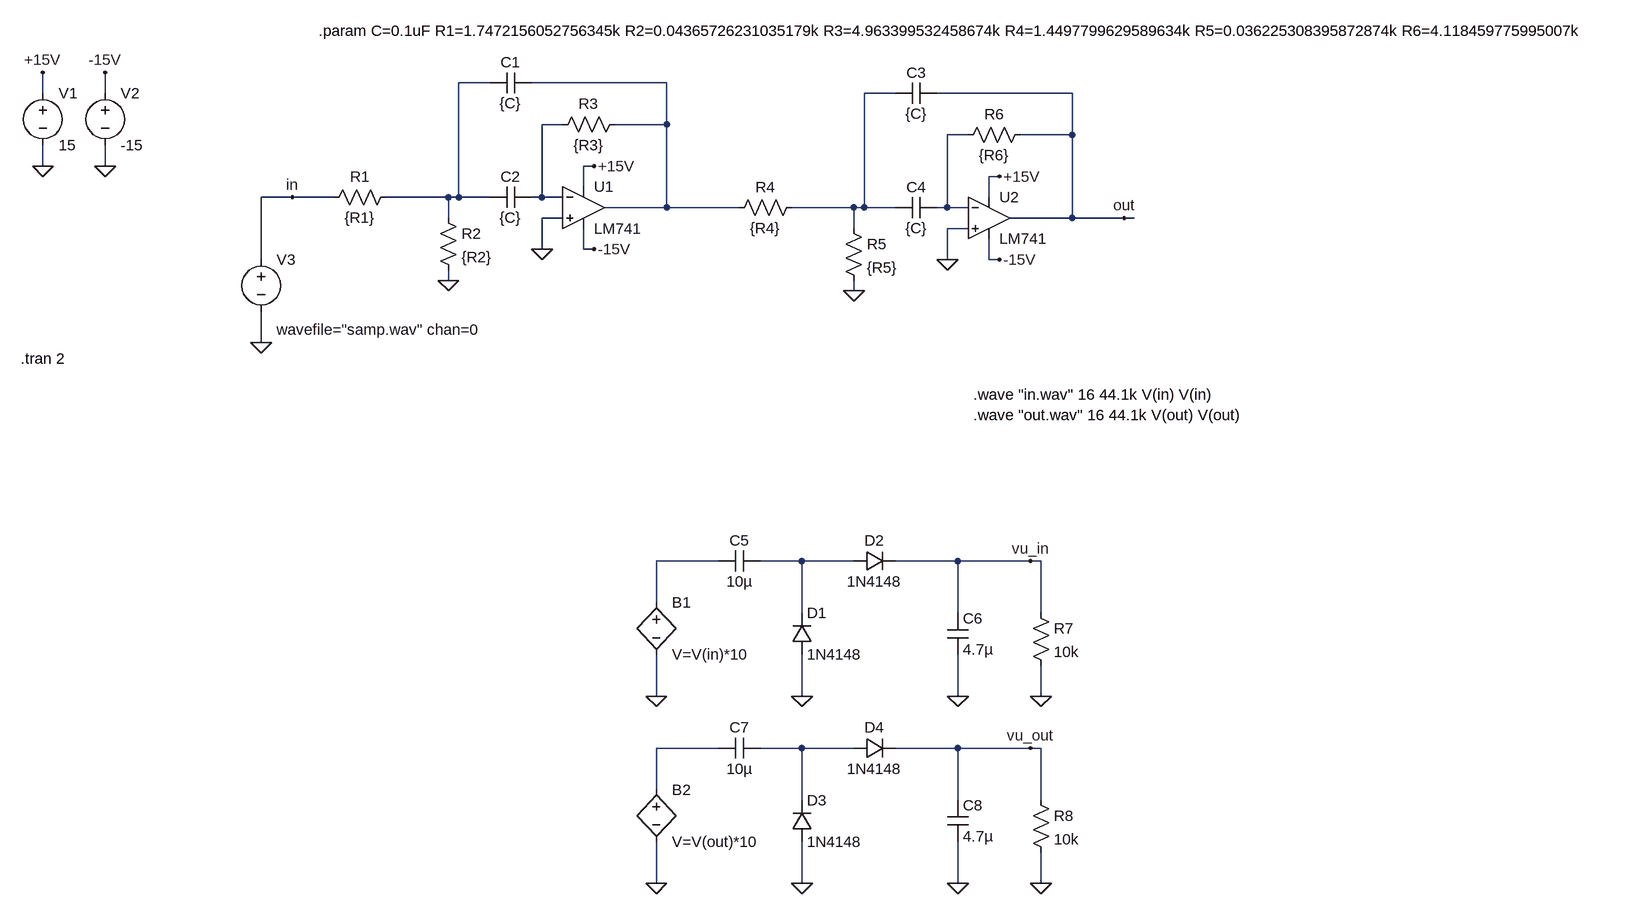
[diagram p0: schematic tone_detect.asc]
tone_detect.asc, the LTspice schematic file:
Version 4
SHEET 1 1964 1188
WIRE 64 -64 16 -64
WIRE 336 -64 128 -64
WIRE -624 -48 -624 -80
WIRE -528 -48 -528 -80
WIRE 688 -48 640 -48
WIRE 960 -48 752 -48
WIRE 176 0 144 0
WIRE 336 0 336 -64
WIRE 336 0 256 0
WIRE 800 16 768 16
WIRE 960 16 960 -48
WIRE 960 16 880 16
WIRE -624 64 -624 32
WIRE -528 64 -528 32
WIRE 224 64 208 64
WIRE 848 80 832 80
WIRE 208 96 208 64
WIRE -240 112 -288 112
WIRE -176 112 -240 112
WIRE 0 112 -96 112
WIRE 16 112 16 -64
WIRE 16 112 0 112
WIRE 64 112 16 112
WIRE 144 112 144 0
WIRE 144 112 128 112
WIRE 176 112 144 112
WIRE 832 112 832 80
WIRE 336 128 336 0
WIRE 336 128 240 128
WIRE 448 128 336 128
WIRE 624 128 528 128
WIRE 640 128 640 -48
WIRE 640 128 624 128
WIRE 688 128 640 128
WIRE 768 128 768 16
WIRE 768 128 752 128
WIRE 800 128 768 128
WIRE 0 144 0 112
WIRE 176 144 144 144
WIRE 960 144 960 16
WIRE 960 144 864 144
WIRE 1040 144 960 144
WIRE 1056 144 1040 144
WIRE 624 160 624 128
WIRE 800 160 768 160
WIRE 144 192 144 144
WIRE 208 192 208 160
WIRE 224 192 208 192
WIRE -288 208 -288 112
WIRE 768 208 768 160
WIRE 832 208 832 176
WIRE 848 208 832 208
WIRE 0 240 0 224
WIRE 624 256 624 240
WIRE -288 336 -288 288
WIRE 416 672 320 672
WIRE 544 672 480 672
WIRE 624 672 544 672
WIRE 784 672 688 672
WIRE 896 672 784 672
WIRE 912 672 896 672
WIRE 320 736 320 672
WIRE 544 752 544 672
WIRE 784 752 784 672
WIRE 912 752 912 672
WIRE 320 880 320 816
WIRE 544 880 544 816
WIRE 784 880 784 816
WIRE 912 880 912 832
WIRE 416 960 320 960
WIRE 544 960 480 960
WIRE 624 960 544 960
WIRE 784 960 688 960
WIRE 896 960 784 960
WIRE 912 960 896 960
WIRE 320 1024 320 960
WIRE 544 1040 544 960
WIRE 784 1040 784 960
WIRE 912 1040 912 960
WIRE 320 1168 320 1104
WIRE 544 1168 544 1104
WIRE 784 1168 784 1104
WIRE 912 1168 912 1120
FLAG 224 64 +15V
FLAG 224 192 -15V
FLAG -624 64 0
FLAG -624 -80 +15V
FLAG -528 64 0
FLAG -528 -80 -15V
FLAG 144 192 0
FLAG 0 240 0
FLAG -240 112 in
FLAG -288 336 0
FLAG 848 80 +15V
FLAG 848 208 -15V
FLAG 768 208 0
FLAG 624 256 0
FLAG 1040 144 out
FLAG 320 880 0
FLAG 544 880 0
FLAG 784 880 0
FLAG 912 880 0
FLAG 896 672 vu_in
FLAG 320 1168 0
FLAG 544 1168 0
FLAG 784 1168 0
FLAG 912 1168 0
FLAG 896 960 vu_out
SYMBOL Opamps\\LM741 208 64 R0
SYMATTR InstName U1
SYMBOL voltage -624 -64 R0
WINDOW 123 0 0 Left 0
WINDOW 39 0 0 Left 0
SYMATTR InstName V1
SYMATTR Value 15
SYMBOL voltage -528 -64 R0
WINDOW 123 0 0 Left 0
WINDOW 39 0 0 Left 0
SYMATTR InstName V2
SYMATTR Value -15
SYMBOL cap 128 -80 R90
WINDOW 0 0 32 VBottom 2
WINDOW 3 32 32 VTop 2
SYMATTR InstName C1
SYMATTR Value {C}
SYMBOL cap 128 96 R90
WINDOW 0 0 32 VBottom 2
WINDOW 3 32 32 VTop 2
SYMATTR InstName C2
SYMATTR Value {C}
SYMBOL res -16 128 R0
SYMATTR InstName R2
SYMATTR Value {R2}
SYMBOL res -192 128 R270
WINDOW 0 32 56 VTop 2
WINDOW 3 0 56 VBottom 2
SYMATTR InstName R1
SYMATTR Value {R1}
SYMBOL res 272 -16 R90
WINDOW 0 0 56 VBottom 2
WINDOW 3 32 56 VTop 2
SYMATTR InstName R3
SYMATTR Value {R3}
SYMBOL voltage -288 192 R0
WINDOW 123 24 124 Left 2
WINDOW 39 0 0 Left 0
SYMATTR InstName V3
SYMATTR Value ""
SYMATTR Value2 wavefile="samp.wav" chan=0
SYMBOL Opamps\\LM741 832 80 R0
SYMATTR InstName U2
SYMBOL cap 752 -64 R90
WINDOW 0 0 32 VBottom 2
WINDOW 3 32 32 VTop 2
SYMATTR InstName C3
SYMATTR Value {C}
SYMBOL cap 752 112 R90
WINDOW 0 0 32 VBottom 2
WINDOW 3 32 32 VTop 2
SYMATTR InstName C4
SYMATTR Value {C}
SYMBOL res 608 144 R0
SYMATTR InstName R5
SYMATTR Value {R5}
SYMBOL res 432 144 R270
WINDOW 0 32 56 VTop 2
WINDOW 3 0 56 VBottom 2
SYMATTR InstName R4
SYMATTR Value {R4}
SYMBOL res 896 0 R90
WINDOW 0 0 56 VBottom 2
WINDOW 3 32 56 VTop 2
SYMATTR InstName R6
SYMATTR Value {R6}
SYMBOL bv 320 720 R0
SYMATTR InstName B1
SYMATTR Value V=V(in)*10
SYMBOL cap 480 656 R90
WINDOW 0 0 32 VBottom 2
WINDOW 3 32 32 VTop 2
SYMATTR InstName C5
SYMATTR Value 10µ
SYMBOL diode 528 816 M180
WINDOW 0 24 64 Left 2
WINDOW 3 24 0 Left 2
SYMATTR InstName D1
SYMATTR Value 1N4148
SYMBOL diode 624 656 M90
WINDOW 0 0 32 VBottom 2
WINDOW 3 32 32 VTop 2
SYMATTR InstName D2
SYMATTR Value 1N4148
SYMBOL cap 768 752 R0
SYMATTR InstName C6
SYMATTR Value 4.7µ
SYMBOL res 896 736 R0
SYMATTR InstName R7
SYMATTR Value 10k
SYMBOL bv 320 1008 R0
SYMATTR InstName B2
SYMATTR Value V=V(out)*10
SYMBOL cap 480 944 R90
WINDOW 0 0 32 VBottom 2
WINDOW 3 32 32 VTop 2
SYMATTR InstName C7
SYMATTR Value 10µ
SYMBOL diode 528 1104 M180
WINDOW 0 24 64 Left 2
WINDOW 3 24 0 Left 2
SYMATTR InstName D3
SYMATTR Value 1N4148
SYMBOL diode 624 944 M90
WINDOW 0 0 32 VBottom 2
WINDOW 3 32 32 VTop 2
SYMATTR InstName D4
SYMATTR Value 1N4148
SYMBOL cap 768 1040 R0
SYMATTR InstName C8
SYMATTR Value 4.7µ
SYMBOL res 896 1024 R0
SYMATTR InstName R8
SYMATTR Value 10k
TEXT -200 -144 Left 2 !.param C=0.1uF R1=1.7472156052756345k R2=0.04365726231035179k R3=4.963399532458674k R4=1.4497799629589634k R5=0.036225308395872874k R6=4.118459775995007k
TEXT -658 360 Left 2 !.tran 2
TEXT 808 416 Left 2 !.wave "in.wav" 16 44.1k V(in) V(in)\n.wave "out.wav" 16 44.1k V(out) V(out)

The netlist it stands for:
* tone_detect.asc
XU1 0 N004 +15V -15V N002 LM741  ; pins In+ In- V+ V- OUT
V1 +15V 0 15
V2 -15V 0 -15
C1 N002 N001 {C}
C2 N004 N001 {C}
R2 N001 0 {R2}
R1 in N001 {R1}
R3 N002 N004 {R3}
V3 in 0 wavefile="samp.wav" chan=0
XU2 0 N005 +15V -15V out LM741  ; pins In+ In- V+ V- OUT
C3 out N003 {C}
C4 N005 N003 {C}
R5 N003 0 {R5}
R4 N002 N003 {R4}
R6 out N005 {R6}
B1 N006 0 V=V(in)*10
C5 N007 N006 10µ
D1 0 N007 1N4148
D2 N007 vu_in 1N4148
C6 vu_in 0 4.7µ
R7 vu_in 0 10k
B2 N008 0 V=V(out)*10
C7 N009 N008 10µ
D3 0 N009 1N4148
D4 N009 vu_out 1N4148
C8 vu_out 0 4.7µ
R8 vu_out 0 10k
.model D D
.lib standard.dio
.param C=0.1uF R1=1.7472156052756345k R2=0.04365726231035179k R3=4.963399532458674k R4=1.4497799629589634k R5=0.036225308395872874k R6=4.118459775995007k
.tran 2
.wave "in.wav" 16 44.1k V(in) V(in)
.wave "out.wav" 16 44.1k V(out) V(out)
.lib LM741.lib
.backanno
.end